# Altium schematic sheet 2025.SchDoc
size A4
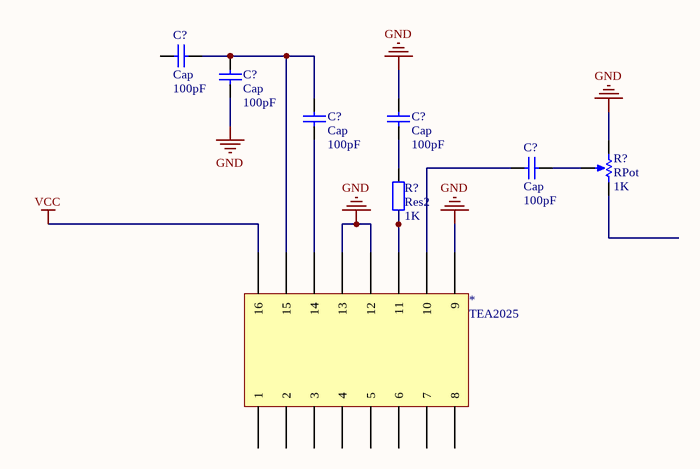
[diagram p0: 2025.SchDoc]

## Parts
(Parts that share a designator on the sheet are numbered #1, #2 ... from top to bottom, then left to right.)
*  TEA2025
C?#1  Cap  value 100pF  [RAD-0.3]
C?#2  Cap  value 100pF  [RAD-0.3]
C?#3  Cap  value 100pF  [RAD-0.3]
C?#4  Cap  value 100pF  [RAD-0.3]
C?#5  Cap  value 100pF  [RAD-0.3]
R?#1  RPot  value 1K  [VR5]
R?#2  Res2  value 1K  [AXIAL-0.4]

## Nets
GND: *.GND(4) C?#2.1 C?#4.2 R?#1.1(TOP)
VCC: *.+VS(16)
Net*_BOOT.1: *.BOOT.1(14) C?#3.2
Net*_FEEDBACK: *.FEEDBACK(6) R?#2.2
Net*_IN.1(+): *.IN.1(+)(10) C?#5.1
Net*_OUT.1: *.OUT.1(15) C?#1.2 C?#2.2 C?#3.1
NetC?#4_1: C?#4.1 R?#2.1
NetC?#5_2: C?#5.2 R?#1.3(TAP)

Not connected (* = marked no-connect by the designer): * BOOT.2(3) BRIDGE(1) IN.2(+)(7) OUT.2(2) SVR(8); C?#1 1; R?#1 2(BOT)

## Library data of the parts
C?#1-C?#5 = Cap: Capacitor; Published: 8-Jun-2000; LatestRevisionDate: 17-Jul-2002; LatestRevisionNote: Re-released for DXP Platform.; PackageReference: RAD-0.3; Publisher: Altium Limited
R?#1 = RPot: Potentiometer; Sim Note: Enter the Resistance value and the set point into parameter fields.; Set Position: 0.5; Published: 8-Jun-2000; LatestRevisionDate: 17-Jul-2002; LatestRevisionNote: Re-released for DXP Platform.; PackageReference: VR5; Publisher: Altium Limited
R?#2 = Res2: Resistor; Published: 8-Jun-2000; LatestRevisionDate: 17-Jul-2002; LatestRevisionNote: Re-released for DXP Platform.; PackageReference: AXIAL-0.4; Publisher: Altium Limited